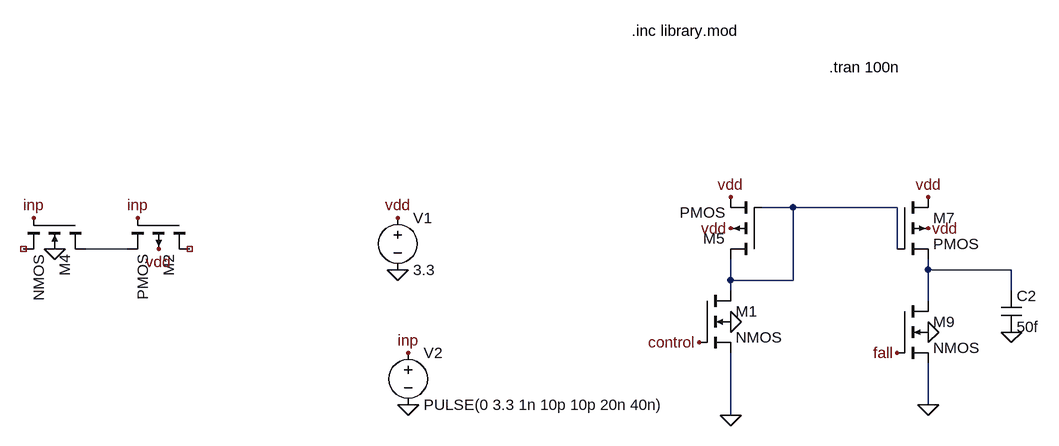
[diagram p0: schematic project.asc]
project.asc, the LTspice schematic file:
Version 4
SHEET 1 1368 1052
WIRE 112 144 64 144
WIRE 272 144 112 144
WIRE -912 208 -976 208
WIRE 272 208 272 144
WIRE 320 240 320 224
WIRE 448 240 320 240
WIRE 16 256 16 224
WIRE 112 256 112 144
WIRE 112 256 16 256
WIRE 16 272 16 256
WIRE 448 272 448 240
WIRE 320 288 320 240
WIRE 320 448 320 384
WIRE 16 464 16 368
FLAG -496 240 0
FLAG -496 160 vdd
FLAG -480 448 0
FLAG -480 368 inp
FLAG 16 128 vdd
FLAG 16 176 vdd
FLAG 320 128 vdd
FLAG 320 176 vdd
FLAG 320 336 0
FLAG 448 336 0
FLAG 272 368 fall
FLAG 16 464 0
FLAG 320 448 0
FLAG -896 160 inp
FLAG -864 208 vdd
FLAG -1024 208 0
FLAG -1056 160 inp
FLAG 16 320 0
FLAG -32 352 control
SYMBOL voltage -496 144 R0
WINDOW 123 0 0 Left 0
WINDOW 39 0 0 Left 0
SYMATTR InstName V1
SYMATTR Value 3.3
SYMBOL voltage -480 352 R0
WINDOW 123 0 0 Left 0
WINDOW 39 0 0 Left 0
SYMATTR InstName V2
SYMATTR Value PULSE(0 3.3 1n 10p 10p 20n 40n)
SYMBOL pmos4 64 224 R180
SYMATTR InstName M5
SYMATTR Value2 l=0.6u w=0.6u
SYMBOL pmos4 272 128 R0
SYMATTR InstName M7
SYMATTR Value2 l=0.6u w=0.6u
SYMBOL nmos4 272 288 R0
SYMATTR InstName M9
SYMATTR Value2 l=0.35u w=2.5u
SYMBOL cap 432 272 R0
SYMATTR InstName C2
SYMATTR Value 50f
SYMBOL pmos4 -816 160 R90
SYMATTR InstName M2
SYMATTR Value2 l=0.35u w=2.5u
SYMBOL nmos4 -976 160 R90
SYMATTR InstName M4
SYMATTR Value2 l=0.35u w=2.5u
SYMBOL nmos4 -32 272 R0
SYMATTR InstName M1
SYMATTR Value2 l=0.35u w=2.5u
TEXT -136 -128 Left 2 !.inc library.mod
TEXT 168 -72 Left 2 !.tran 100n

The netlist it stands for:
* project.asc
V1 vdd 0 3.3
V2 inp 0 PULSE(0 3.3 1n 10p 10p 20n 40n)
M5 N001 N001 vdd vdd PMOS l=0.6u w=0.6u
M7 vdd N001 N003 vdd PMOS l=0.6u w=0.6u
M9 N003 fall 0 0 NMOS l=0.35u w=2.5u
C2 N003 0 50f
M2 NC_01 inp N002 vdd PMOS l=0.35u w=2.5u
M4 N002 inp NC_02 0 NMOS l=0.35u w=2.5u
M1 N001 control 0 0 NMOS l=0.35u w=2.5u
.model NMOS NMOS
.model PMOS PMOS
.lib standard.mos
.inc library.mod
.tran 100n
.backanno
.end